# EasyEDA schematic [EasyEDA] ir-rgb-controller-chematic.json
TITLE: ir-rgb-controller; REV: 1.0; Date: 2020-08-27; Sheet: 1/1; Drawn By: Apochromat; Company: None
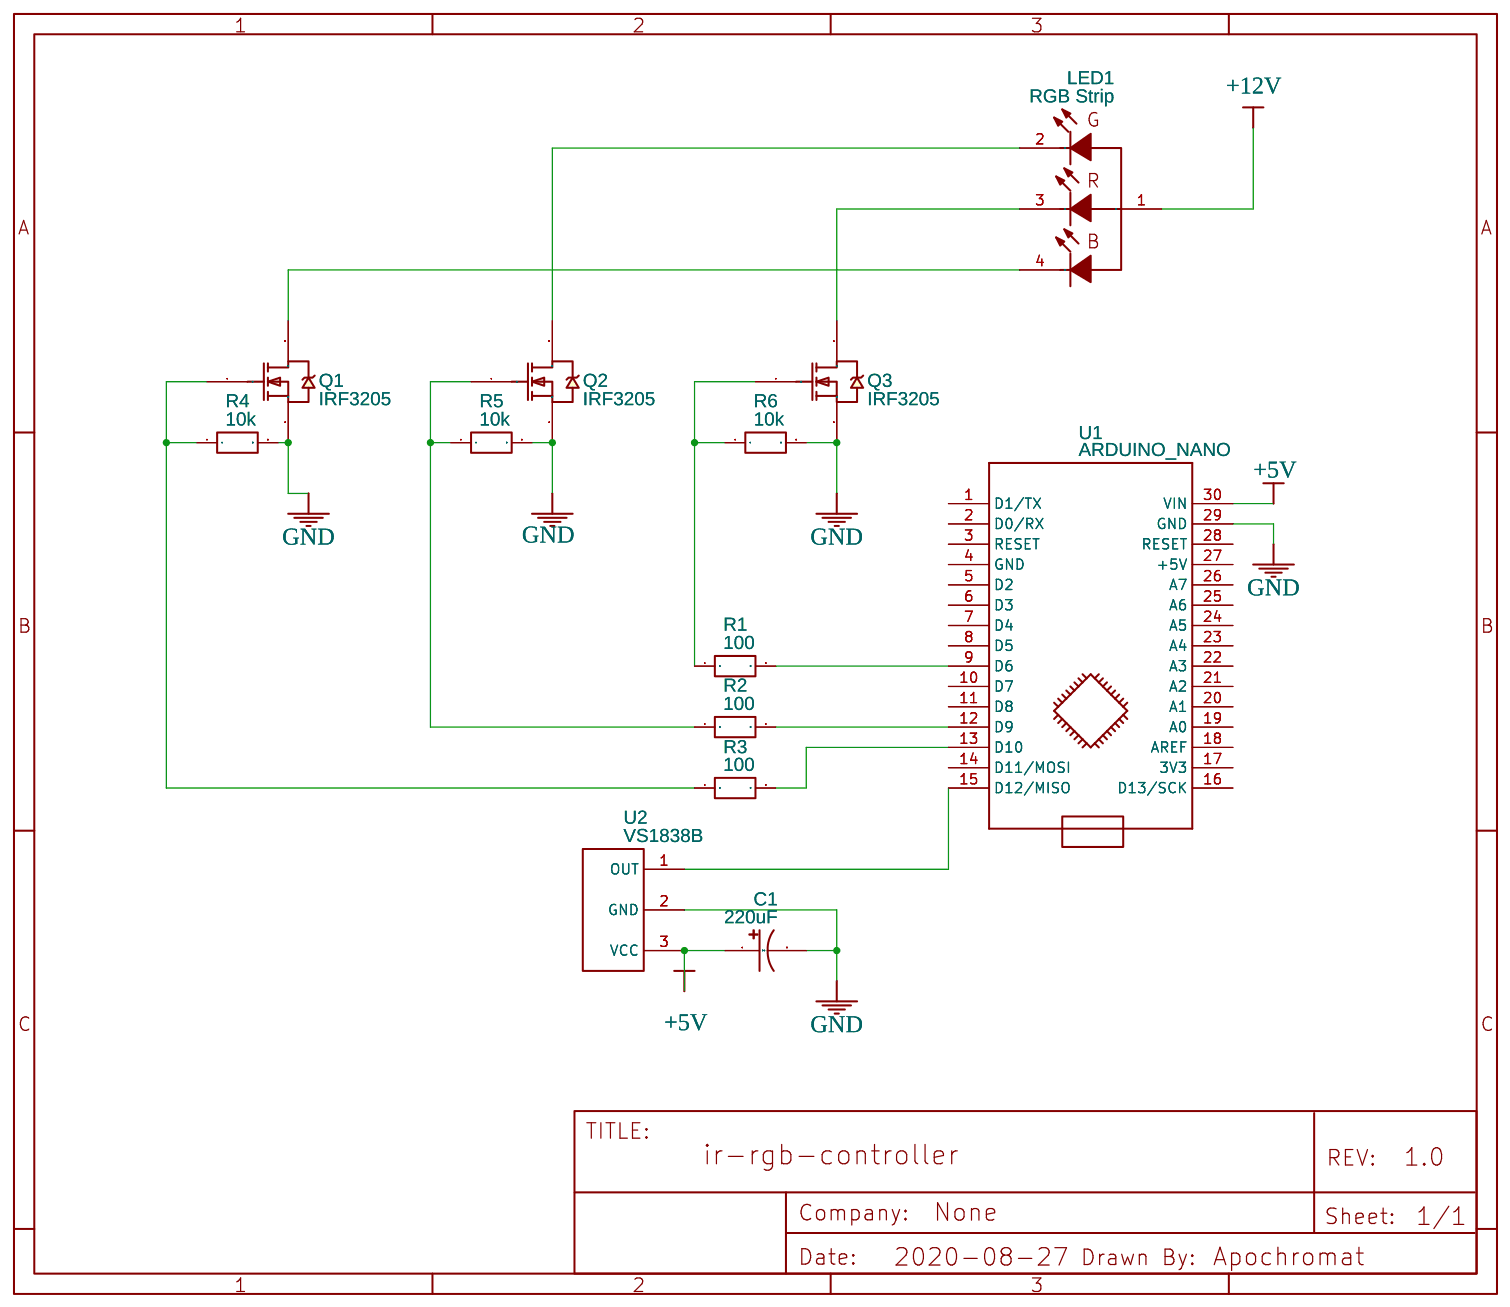
[diagram p0: schematic sheet]

## Parts
C1  220uF  [CAP-TH_BD6.3-P2.50-D1.0-FD]
LED1  RGB Strip  [WJ2EDGVC-5.08-4P]
Q1  IRF3205  [TO-220AB]
Q2  IRF3205  [TO-220AB]
Q3  IRF3205  [TO-220AB]
R1  100  [R_AXIAL-0.4]
R2  100  [R_AXIAL-0.4]
R3  100  [R_AXIAL-0.4]
R4  10k  [R_AXIAL-0.4]
R5  10k  [R_AXIAL-0.4]
R6  10k  [R_AXIAL-0.4]
U1  ARDUINO_NANO  [ARDUINO_NANO]
U2  VS1838B  [VS1838B]

## Library data of the parts
C1 = NHA 25V220uF: Supplier: LCSC; Supplier Part: C165659; Manufacturer: SamYoung Electronics; Contributor: LCSC
LED1 = RGB Strip: Contributor: LCSC
Q1-Q3 = IRF3205: HEXFET Power MOSFET
R1-R6 = R_AXIAL-0.4_EU: Contributor: LCEDA_Lib
U1 = ARDUINO_NANO: sourceId: KGSeAWhDB
U2 = VS1838B: Contributor: franx411

## Nets
+5V: C1.1 U1.30(VIN) U2.3(VCC)
+12V: LED1.1(CA)
GND: C1.2 Q1.3(S) Q2.3(S) Q3.3(S) R4.2 R5.2 R6.2 U1.29(GND) U2.2(GND)
Net-(LED1-2): LED1.2(KG) Q2.2(D)
Net-(LED1-3): LED1.3(KR) Q3.2(D)
Net-(LED1-4): LED1.4(KB) Q1.2(D)
Net-(Q1-1): Q1.1(G) R3.1 R4.1
Net-(Q2-1): Q2.1(G) R2.1 R5.1
Net-(Q3-1): Q3.1(G) R1.1 R6.1
Net-(R1-2): R1.2 U1.9(D6)
Net-(R2-2): R2.2 U1.12(D9)
Net-(R3-2): R3.2 U1.13(D10)
Net-(U1-15): U1.15(D12/MISO) U2.1(OUT)

Not connected (* = marked no-connect by the designer): U1 1(D1/TX) 2(D0/RX) 3(RESET) 4(GND) 5(D2) 6(D3) 7(D4) 8(D5) 10(D7) 11(D8) 14(D11/MOSI) 16(D13/SCK) 17(3V3) 18(AREF) 19(A0) 20(A1) 21(A2) 22(A3) 23(A4) 24(A5) 25(A6) 26(A7) 27(+5V) 28(RESET)
